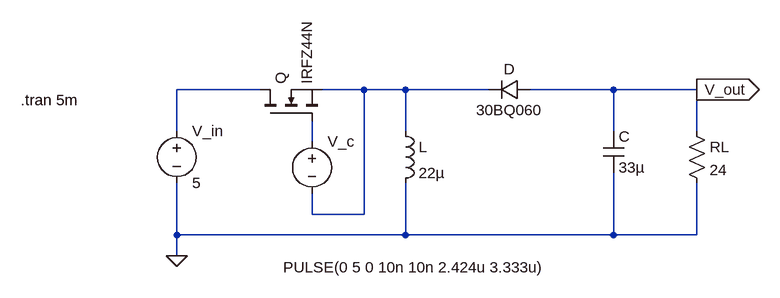
[diagram p0: schematic simulation.asc]
simulation.asc, the LTspice schematic file:
Version 4.1
SHEET 1 3192 2404
WIRE 1248 1248 1120 1248
WIRE 1408 1248 1344 1248
WIRE 1472 1248 1408 1248
WIRE 1600 1248 1472 1248
WIRE 1792 1248 1664 1248
WIRE 1920 1248 1792 1248
WIRE 1120 1312 1120 1248
WIRE 1472 1312 1472 1248
WIRE 1792 1312 1792 1248
WIRE 1920 1312 1920 1248
WIRE 1328 1328 1328 1296
WIRE 1328 1440 1328 1408
WIRE 1408 1440 1408 1248
WIRE 1408 1440 1328 1440
WIRE 1120 1472 1120 1392
WIRE 1472 1472 1472 1392
WIRE 1472 1472 1120 1472
WIRE 1792 1472 1792 1376
WIRE 1792 1472 1472 1472
WIRE 1920 1472 1920 1392
WIRE 1920 1472 1792 1472
WIRE 1120 1504 1120 1472
FLAG 1120 1504 0
FLAG 1920 1248 V_out
IOPIN 1920 1248 Out
SYMBOL voltage 1120 1296 R0
WINDOW 123 0 0 Left 0
WINDOW 39 0 0 Left 0
SYMATTR InstName V_in
SYMATTR Value 5
SYMBOL nmos 1248 1296 R270
SYMATTR InstName Q
SYMATTR Value IRFZ44N
SYMBOL ind 1456 1296 R0
SYMATTR InstName L
SYMATTR Value 22µ
SYMATTR SpiceLine Rser=50m
SYMBOL diode 1664 1232 R90
WINDOW 0 0 32 VBottom 2
WINDOW 3 32 32 VTop 2
SYMATTR InstName D
SYMATTR Value 30BQ060
SYMBOL cap 1776 1312 R0
SYMATTR InstName C
SYMATTR Value 33µ
SYMATTR SpiceLine V=25 Irms=0 Rser=5m Lser=0
SYMBOL res 1904 1296 R0
SYMATTR InstName RL
SYMATTR Value 24
SYMBOL voltage 1328 1312 R0
WINDOW 3 -44 210 Left 2
WINDOW 123 0 0 Left 0
WINDOW 39 0 0 Left 0
SYMATTR Value PULSE(0 5 0 10n 10n 2.424u 3.333u)
SYMATTR InstName V_c
TEXT 880 1264 Left 2 !.tran 5m

The netlist it stands for:
* simulation.asc
V_in N001 0 5
M§Q N001 N003 N002 N002 IRFZ44N
L N002 0 22µ Rser=50m
D V_out N002 30BQ060
C V_out 0 33µ V=25 Irms=0 Rser=5m Lser=0
RL V_out 0 24
V_c N003 N002 PULSE(0 5 0 10n 10n 2.424u 3.333u)
.model D D
.lib standard.dio
.model NMOS NMOS
.model PMOS PMOS
.lib standard.mos
.tran 5m
.backanno
.end